# Altium schematic sheet Acceleration_Sensing_Module.SchDoc
size A4
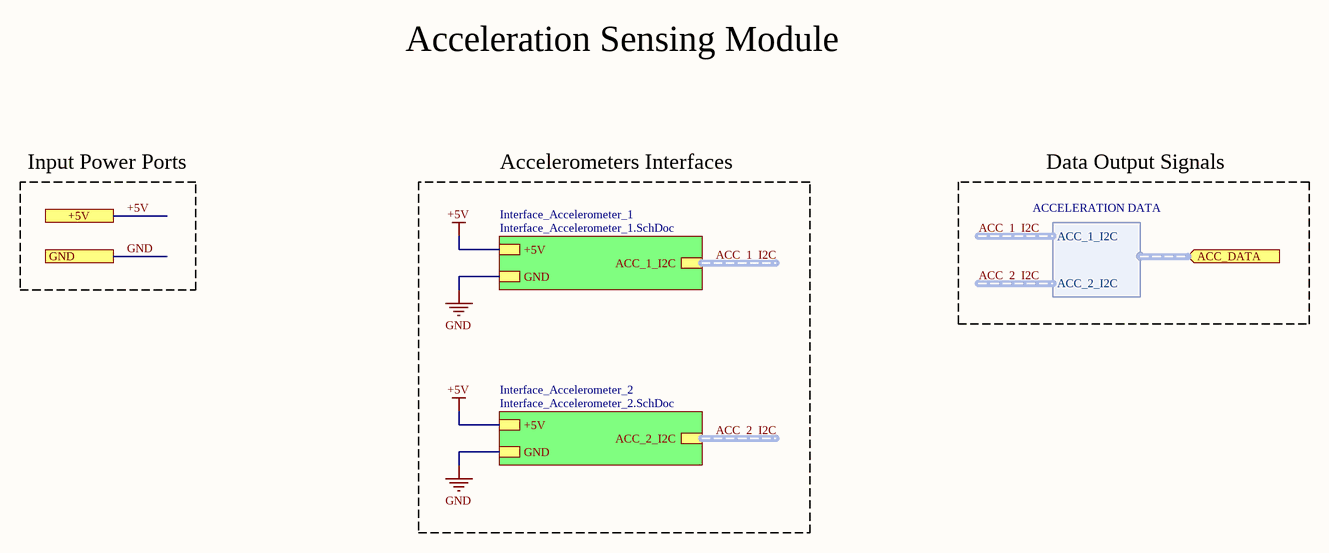
[diagram p0: Acceleration_Sensing_Module.SchDoc]

## Sub-sheets
Interface_Accelerometer_1 = Interface_Accelerometer_1.SchDoc: ACC_1_I2C (harness I2C), GND, +5V
Interface_Accelerometer_2 = Interface_Accelerometer_2.SchDoc: ACC_2_I2C (harness I2C), GND, +5V

## Ports
+5V, ACC_DATA (in, harness ACCELERATION DATA), GND

## Harnesses
ACCELERATION DATA: ACC_1_I2C, ACC_2_I2C

## Nets
+5V: port +5V, sheet Interface_Accelerometer_1/+5V, sheet Interface_Accelerometer_2/+5V
GND: port GND, sheet Interface_Accelerometer_1/GND, sheet Interface_Accelerometer_2/GND

## Buses and harness runs
harness ACC_1_I2C = sheet Interface_Accelerometer_1/ACC_1_I2C
harness ACC_2_I2C = sheet Interface_Accelerometer_2/ACC_2_I2C

## Notes on the sheet
- Acceleration Sensing Module
- Input Power Ports
- Accelerometers Interfaces
- Data Output Signals